# Altium schematic sheet car_engineSteering.SchDoc
size A4; SheetNumber: 1; SheetTotal: 2
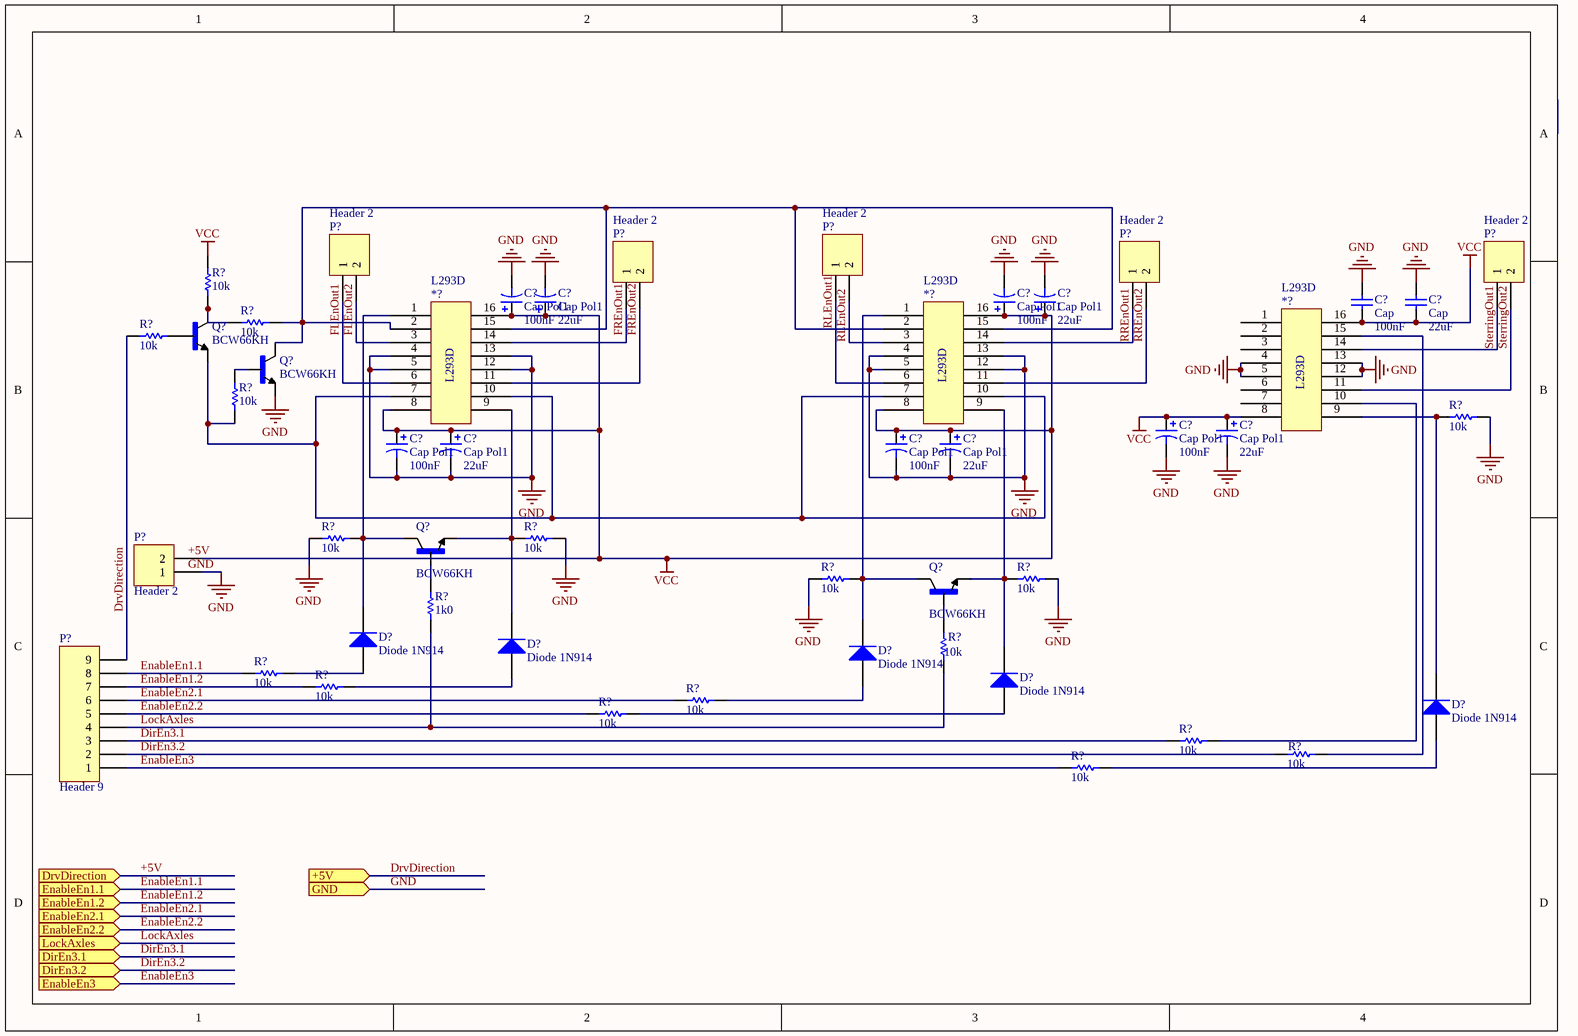
[diagram p0: car_engineSteering.SchDoc]

## Parts
(Parts that share a designator on the sheet are numbered #1, #2 ... from top to bottom, then left to right.)
*?#1  L293D  [DIP-16]
*?#2  L293D  [DIP-16]
*?#3  L293D  [DIP-16]
C?#1  Cap  value 100nF  [Cap_0603_HD]
C?#2  Cap  value 22uF  [Cap_0603_HD]
C?#3  Cap Pol1  value 100nF  [Cap_0603_HD]
C?#4  Cap Pol1  value 22uF  [Cap_0603_HD]
C?#5  Cap Pol1  value 100nF  [Cap_0603_HD]
C?#6  Cap Pol1  value 22uF  [Cap_0603_HD]
C?#7  Cap Pol1  value 100nF  [Cap_0603_HD]
C?#8  Cap Pol1  value 22uF  [Cap_0603_HD]
C?#9  Cap Pol1  value 100nF  [Cap_0603_HD]
C?#10  Cap Pol1  value 22uF  [Cap_0603_HD]
C?#11  Cap Pol1  value 100nF  [Cap_0603_HD]
C?#12  Cap Pol1  value 22uF  [Cap_0603_HD]
D?#1  Diode 1N914  [DO-35]
D?#2  Diode 1N914  [DO-35]
D?#3  Diode 1N914  [DO-35]
D?#4  Diode 1N914  [DO-35]
D?#5  Diode 1N914  [DO-35]
P?#1  Header 2  [HDR1X2]
P?#2  Header 2  [HDR1X2]
P?#3  Header 2  [HDR1X2]
P?#4  Header 2  [HDR1X2]
P?#5  Header 2  [HDR1X2]
P?#6  Header 2  [HDR1X2]
P?#7  Header 9  [HDR1X9]
Q?#1  BCW66KH  [TO-92A]
Q?#2  BCW66KH  [TO-92A]
Q?#3  BCW66KH  [TO-92A]
Q?#4  BCW66KH  [TO-92A]
R?#1  value 10k  [Res_0603_HD_outliine]  (hidden comment: Res)
R?#2  value 10k  [Res_0603_HD_outliine]  (hidden comment: Res)
R?#3  value 10k  [Res_0603_HD_outliine]  (hidden comment: Res)
R?#4  value 10k  [Res_0603_HD_outliine]  (hidden comment: Res)
R?#5  value 10k  [Res_0603_HD_outliine]  (hidden comment: Res)
R?#6  value 10k  [Res_0603_HD_outliine]  (hidden comment: Res)
R?#7  value 10k  [Res_0603_HD_outliine]  (hidden comment: Res)
R?#8  value 10k  [Res_0603_HD_outliine]  (hidden comment: Res)
R?#9  value 10k  [Res_0603_HD_outliine]  (hidden comment: Res)
R?#10  value 1k0  [Res_0603_HD_outliine]  (hidden comment: Res)
R?#11  value 10k  [Res_0603_HD_outliine]  (hidden comment: Res)
R?#12  value 10k  [Res_0603_HD_outliine]  (hidden comment: Res)
R?#13  value 10k  [Res_0603_HD_outliine]  (hidden comment: Res)
R?#14  value 10k  [Res_0603_HD_outliine]  (hidden comment: Res)
R?#15  value 10k  [Res_0603_HD_outliine]  (hidden comment: Res)
R?#16  value 10k  [Res_0603_HD_outliine]  (hidden comment: Res)
R?#17  value 10k  [Res_0603_HD_outliine]  (hidden comment: Res)
R?#18  value 10k  [Res_0603_HD_outliine]  (hidden comment: Res)

## Ports
+5V (in), DirEn3.1 (in), DirEn3.2 (in), DrvDirection (in), EnableEn1.1 (in), EnableEn1.2 (in), EnableEn2.1 (in), EnableEn2.2 (in), EnableEn3 (in), GND (in), LockAxles (in)

## Nets
GND: *?#1.4 *?#1.5 *?#1.12 *?#1.13 *?#2.4 *?#2.5 *?#2.12 *?#2.13 *?#3.4 *?#3.5 *?#3.12 *?#3.13 C?#1.1 C?#2.1 C?#3.2 C?#4.2 C?#5.2 C?#6.2 C?#7.2 C?#8.2 C?#9.2 C?#10.2 C?#11.2 C?#12.2 P?#6.1 Q?#2.1(B) R?#5.2 R?#6.1 R?#7.2 R?#8.1 R?#9.2 ; port GND
VCC: *?#1.8 *?#1.16 *?#2.8 *?#2.16 *?#3.8 *?#3.16 C?#1.2 C?#2.2 C?#3.1 C?#4.1 C?#5.1 C?#6.1 C?#7.1 C?#8.1 C?#9.1 C?#10.1 C?#11.1 C?#12.1 P?#6.2 R?#1.2
+5V: port DrvDirection
DirEn3.1: P?#7.3 R?#16.1 ; port DirEn3.1
DirEn3.2: P?#7.2 R?#17.1 ; port DirEn3.2
DrvDirection: P?#7.9 R?#3.2 ; port +5V
EnableEn1.1: P?#7.8 R?#12.1 ; port EnableEn1.1
EnableEn1.2: P?#7.7 R?#13.1 ; port EnableEn1.2
EnableEn2.1: P?#7.6 R?#14.1 ; port EnableEn2.1
EnableEn2.2: P?#7.5 R?#15.1 ; port EnableEn2.2
EnableEn3: P?#7.1 R?#18.1 ; port EnableEn3
FLEnOut1: *?#1.6 P?#1.1
FLEnOut2: *?#1.3 P?#1.2
FREnOut1: *?#1.14 P?#3.1
FREnOut2: *?#1.11 P?#3.2
LockAxles: P?#7.4 R?#10.2 R?#11.2 ; port LockAxles
RLEnOut1: *?#1.2 *?#1.15 *?#2.2 *?#2.6 *?#2.15 P?#2.1 Q?#2.3(C) R?#2.1
RLEnOut2: *?#2.3 P?#2.2
RREnOut1: *?#2.14 P?#4.1
RREnOut2: *?#2.11 P?#4.2
SterringOut1: *?#3.14 P?#5.1
SterringOut2: *?#3.11 P?#5.2
Net*?#1_1: *?#1.1 D?#1.2(K) Q?#3.3(C) R?#6.2
Net*?#1_7: *?#1.7 *?#1.10 *?#2.7 *?#2.10 Q?#1.1(B) R?#4.2
Net*?#1_9: *?#1.9 D?#2.2(K) Q?#3.1(B) R?#7.1
Net*?#2_1: *?#2.1 D?#3.2(K) Q?#4.3(C) R?#8.2
Net*?#2_9: *?#2.9 D?#4.2(K) Q?#4.1(B) R?#9.1
Net*?#3_9: *?#3.9 D?#5.2(K) R?#5.1
Net*?#3_10: *?#3.10 R?#16.2
Net*?#3_15: *?#3.15 R?#17.2
NetD?#1_1: D?#1.1(A) R?#12.2
NetD?#2_1: D?#2.1(A) R?#13.2
NetD?#3_1: D?#3.1(A) R?#14.2
NetD?#4_1: D?#4.1(A) R?#15.2
NetD?#5_1: D?#5.1(A) R?#18.2
NetQ?#1_2: Q?#1.2(E) R?#3.1
NetQ?#1_3: Q?#1.3(C) R?#1.1 R?#2.2
NetQ?#2_2: Q?#2.2(E) R?#4.1
NetQ?#3_2: Q?#3.2(E) R?#10.1
NetQ?#4_2: Q?#4.2(E) R?#11.1

Not connected (* = marked no-connect by the designer): *?#3 1 2 3 6 7

## Notes on the sheet
- Labels drawn without touching a wire or pin: +5V, GND

## Library data of the parts
*?#1-*?#3 = L293D: H-bridge driver
C?#1 C?#2 = Cap: Capacitor; Published: 8-Jun-2000; LatestRevisionDate: 17-Jul-2002; LatestRevisionNote: Re-released for DXP Platform.; PackageReference: RAD-0.3; Publisher: Altium Limited; PackageDescription: Radial Cap, Thru-Hole; 2 Leads; 0.3 in Pin Spacing
C?#3-C?#12 = Cap Pol1: Polarized Capacitor (Radial); Published: 8-Jun-2000; LatestRevisionDate: 17-Jul-2002; LatestRevisionNote: Re-released for DXP Platform.; PackageReference: RB7.6-15; Publisher: Altium Limited; PackageDescription: Polarized Capacitor (Radial); 2 Leads
D?#1-D?#5 = Diode 1N914: High Conductance Fast Diode; Published: 8-Jun-2000; LatestRevisionDate: 17-Jul-2002; LatestRevisionNote: Re-released for DXP Platform.; DatasheetVersion: 1997; PackageReference: DO-35; Publisher: Altium Limited; PackageDescription: Diode, Axial; Body 3.8 x 1.9 mm (LxDia. max), Lead Dia. 0.53 mm (max); Code_JEDEC: DO-204-AH; ComponentLink1Description: Manufacturer Link; ComponentLink1URL: http://www.fairchildsemi.com/; ComponentLink2Description: Datasheet; ComponentLink2URL: http://www.fairchildsemi.com/ds/1N%2F1N4448.pdf
P?#1-P?#6 = Header 2: Header, 2-Pin; LatestRevisionDate: 17-Jul-2002; LatestRevisionNote: Re-released for DXP Platform.; Publisher: Altium Limited
P?#7 = Header 9: Header, 9-Pin; LatestRevisionDate: 17-Jul-2002; LatestRevisionNote: Re-released for DXP Platform.; Publisher: Altium Limited
Q?#1-Q?#4 = BCW66KHE6327: NPN Transistor
R?#1-R?#18 = Res: Resistor